# Altium schematic sheet MCU.SchDoc
size A3; SheetNumber: 6; SheetTotal: 8
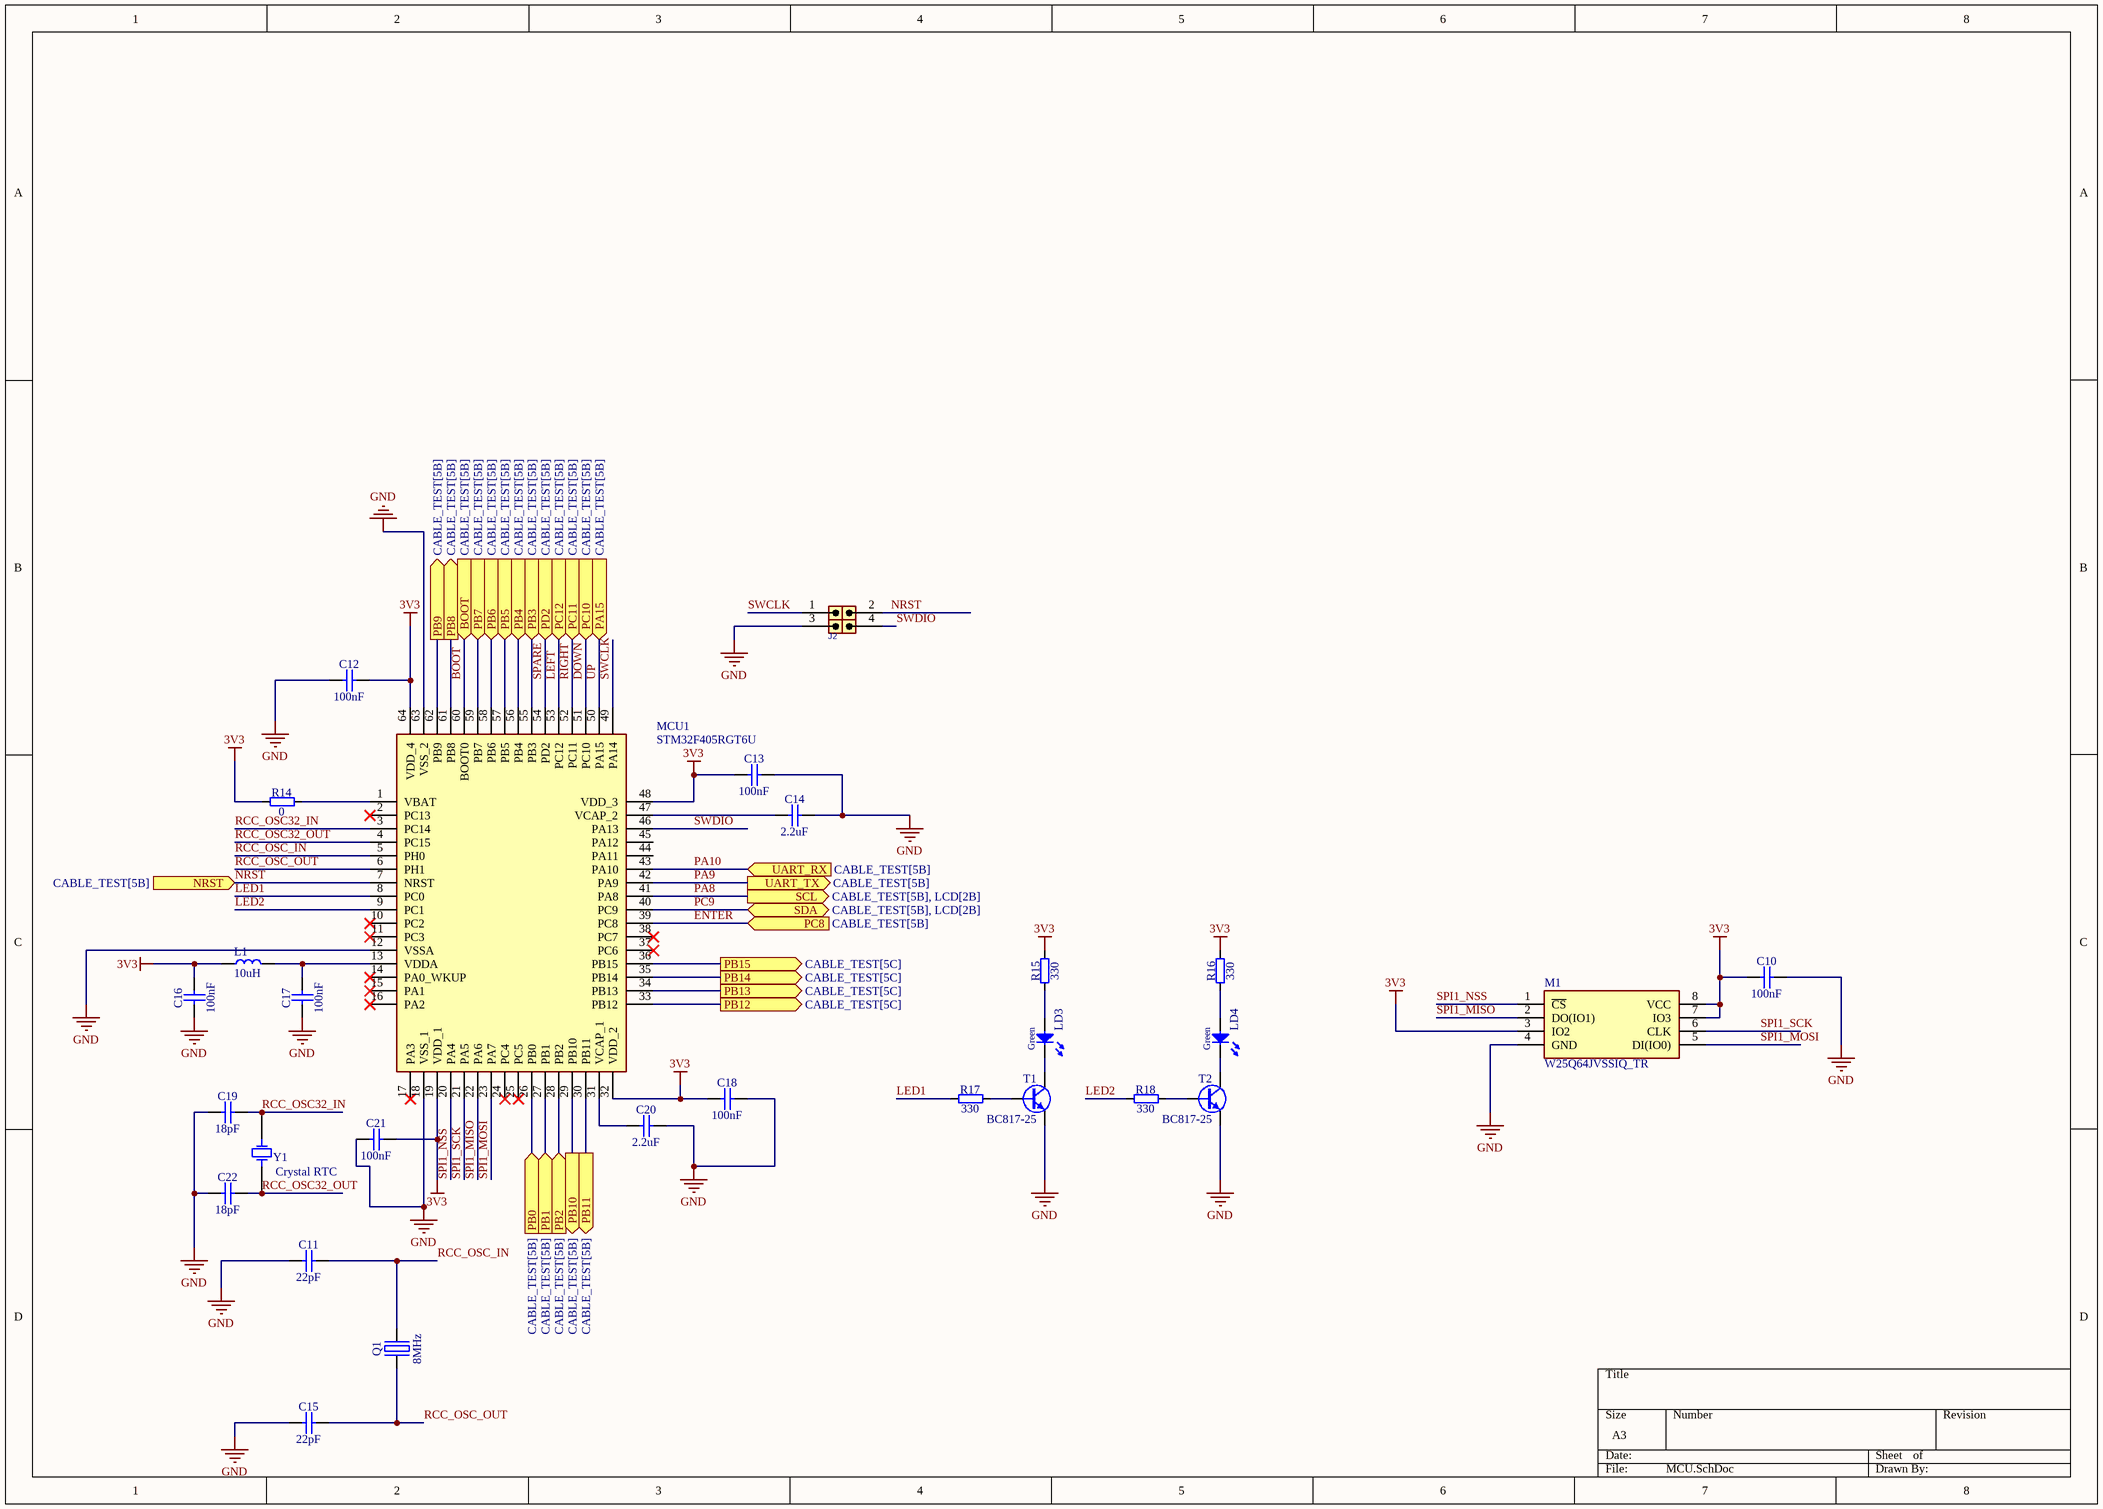
[diagram p0: MCU.SchDoc]

## Parts
C10  100nF  [CAPC2012X135N]
C11  22pF  [CAPC2012X135N]
C12  100nF  [CAPC2012X135N]
C13  100nF  [CAPC2012X135N]
C14  2.2uF  [CAPC2012X135N]
C15  22pF  [CAPC2012X135N]
C16  100nF  [CAPC2012X135N]
C17  100nF  [CAPC2012X135N]
C18  100nF  [CAPC2012X135N]
C19  18pF  [CAPC2012X135N]
C20  2.2uF  [CAPC2012X135N]
C21  100nF  [CAPC2012X135N]
C22  18pF  [CAPC2012X135N]
J2  Female Header dual 2  [HDR_F_2X2]  (value not drawn)
L1  value 10uH  [L0805]  (hidden comment: Inductor SMD NC 0805)
LD3  Green  [LED_3MM_GREEN_1C-2A]
LD4  Green  [LED_3MM_GREEN_1C-2A]
M1  W25Q64JVSSIQ_TR  [SOIC127P790X216-8N]
MCU1  STM32F405RGT6U  [QFP50P1200X1200X160-64N]
Q1  8MHz  [XTAL_CTS_ATS]
R14  0  [RESC2012X60N]
R15  330  [RESC2012X60N]
R16  330  [RESC2012X60N]
R17  330  [RESC2012X60N]
R18  330  [RESC2012X60N]
T1  BC817-25  [SOT95P230X110-3N]
T2  BC817-25  [SOT95P230X110-3N]
Y1  Crystal RTC  [Crystal Clock]

## Ports
BOOT (in, see CABLE_TEST[5B]), NRST (in, see CABLE_TEST[5B]), PA15 (in, see CABLE_TEST[5B]), PB0 (in, see CABLE_TEST[5B]), PB1 (in, see CABLE_TEST[5B]), PB2 (in, see CABLE_TEST[5B]), PB3 (in, see CABLE_TEST[5B]), PB4 (in, see CABLE_TEST[5B]), PB5 (in, see CABLE_TEST[5B]), PB6 (in, see CABLE_TEST[5B]), PB7 (in, see CABLE_TEST[5B]), PB8 (out, see CABLE_TEST[5B]), PB9 (out, see CABLE_TEST[5B]), PB10 (out, see CABLE_TEST[5B]), PB11 (out, see CABLE_TEST[5B]), PB12 (out, see CABLE_TEST[5C]), PB13 (out, see CABLE_TEST[5C]), PB14 (out, see CABLE_TEST[5C]), PB15 (out, see CABLE_TEST[5C]), PC8 (in, see CABLE_TEST[5B]), PC10 (in, see CABLE_TEST[5B]), PC11 (in, see CABLE_TEST[5B]), PC12 (in, see CABLE_TEST[5B]), PD2 (in, see CABLE_TEST[5B]), SCL (out, see CABLE_TEST[5B], LCD[2B]), SDA (bidir, see CABLE_TEST[5B], LCD[2B]), UART_RX (in, see CABLE_TEST[5B]), UART_TX (out, see CABLE_TEST[5B])

## Nets
3V3: C10.1 C12.2 C13.1 C16.2 C18.1 C21.2 L1.1 M1.3(IO2) M1.7(IO3) M1.8(VCC) MCU1.19(VDD_1) MCU1.32(VDD_2) MCU1.48(VDD_3) MCU1.64(VDD_4) R14.1 R15.2 R16.2
GND: C10.2 C11.1 C12.1 C13.2 C14.2 C15.1 C16.1 C17.1 C18.2 C19.1 C20.2 C21.1 C22.1 J2.3 M1.4(GND) MCU1.12(VSSA) MCU1.18(VSS_1) MCU1.63(VSS_2) T1.2(E) T2.2(E)
BOOT: MCU1.60(BOOT0) ; port BOOT
DOWN: MCU1.51(PC10) ; port PC10
ENTER: MCU1.39(PC8) ; port PC8
LED1: MCU1.8(PC0) R17.1
LED2: MCU1.9(PC1) R18.1
LEFT: MCU1.53(PC12) ; port PC12
NRST: J2.2 MCU1.7(NRST) ; port NRST
PA8: MCU1.41(PA8) ; port SCL
PA9: MCU1.42(PA9) ; port UART_TX
PA10: MCU1.43(PA10) ; port UART_RX
PB0: MCU1.26(PB0) ; port PB0
PB1: MCU1.27(PB1) ; port PB1
PB2: MCU1.28(PB2) ; port PB2
PB3: MCU1.55(PB3) ; port PB3
PB4: MCU1.56(PB4) ; port PB4
PB5: MCU1.57(PB5) ; port PB5
PB6: MCU1.58(PB6) ; port PB6
PB7: MCU1.59(PB7) ; port PB7
PB8: MCU1.61(PB8) ; port PB8
PB9: MCU1.62(PB9) ; port PB9
PB10: MCU1.29(PB10) ; port PB10
PB11: MCU1.30(PB11) ; port PB11
PB12: MCU1.33(PB12) ; port PB12
PB13: MCU1.34(PB13) ; port PB13
PB14: MCU1.35(PB14) ; port PB14
PB15: MCU1.36(PB15) ; port PB15
PC9: MCU1.40(PC9) ; port SDA
RCC_OSC32_IN: C19.2 MCU1.3(PC14) Y1.1
RCC_OSC32_OUT: C22.2 MCU1.4(PC15) Y1.2
RCC_OSC_IN: C11.2 MCU1.5(PH0) Q1.2(OSC2)
RCC_OSC_OUT: C15.2 MCU1.6(PH1) Q1.1(OSC1)
RIGHT: MCU1.52(PC11) ; port PC11
SPARE: MCU1.54(PD2) ; port PD2
SPI1_MISO: M1.2(DO(IO1)) MCU1.22(PA6)
SPI1_MOSI: M1.5(DI(IO0)) MCU1.23(PA7)
SPI1_NSS: M1.1(~{CS}) MCU1.20(PA4)
SPI1_SCK: M1.6(CLK) MCU1.21(PA5)
SWCLK: J2.1 MCU1.49(PA14)
SWDIO: J2.4 MCU1.46(PA13)
UP: MCU1.50(PA15) ; port PA15
NetC14_1: C14.1 MCU1.47(VCAP_2)
NetC17_2: C17.2 L1.2 MCU1.13(VDDA)
NetC20_1: C20.1 MCU1.31(VCAP_1)
NetLD3_1: LD3.1(C) T1.3(C)
NetLD3_2: LD3.2(A) R15.1
NetLD4_1: LD4.1(C) T2.3(C)
NetLD4_2: LD4.2(A) R16.1
NetMCU1_1: MCU1.1(VBAT) R14.2
NetR17_2: R17.2 T1.1(B)
NetR18_2: R18.2 T2.1(B)

Not connected (* = marked no-connect by the designer): MCU1 2(PC13)* 10(PC2)* 11(PC3)* 14(PA0_WKUP)* 15(PA1)* 16(PA2)* 17(PA3)* 24(PC4)* 25(PC5)* 37(PC6)* 38(PC7)* 44(PA11) 45(PA12)

## Library data of the parts
C10 = CC0805_1.2PF_50V_0.25PF_NP0: Non-polarised capacitor; Part Description: SMD Multilayer Chip Ceramic Capacitor; Manufacturer: GENERIC; Manufacturer1 Part Number: 223886114128; Voltage: 50V; TC: C0G/NP0; Tolerance: ±0.25pF; Part Number: CC0805_1.2PF_50V_0.25PF_NP0; Component Kind: Standard; Component Type: Standard; Pin Count: 2; Value: 100nF; Status: Not Recommended; Manufacturer Part Number: CC0805_1.2PF_50V_0.25PF_NP0; Case: 0805; Mounted: Yes; Socket: No; SMD: Yes; Sense: No; Manufacturer1 Example: PHYCOMP; Manufacturer1 ComponentHeight: 1.35mm; HelpURL: \\cern.ch\dfs\Applications\Altium\Datasheets\CC0805_NP0_PHYCOMP.pdf; Author: CERN DEM JLC; CreateDate: 12/3/2007; LatestRevisionDate: 12/3/2007
C11-C22 = CC0805_100NF_50V_10%_X7R: Non-polarised capacitor; Part Description: SMD Multilayer Chip Ceramic Capacitor; Manufacturer: GENERIC; Manufacturer1 Part Number: C2012X7R1H104K085; Voltage: 50V; TC: X7R; Tolerance: ±10%; Part Number: CC0805_100NF_50V_10%_X7R; Component Kind: Standard; Component Type: Standard; Pin Count: 2; Status: None; Manufacturer Part Number: CC0805_100NF_50V_10%_X7R; Case: 0805; Mounted: Yes; Socket: No; SMD: Yes; Sense: No; Manufacturer1 Example: TDK; Manufacturer1 ComponentHeight: 1mm; HelpURL: \\cern.ch\dfs\Applications\Altium\Datasheets\CC0805_X7R_TDK_C.pdf; Author: CERN DEM JLC; CreateDate: 12/3/2007; LatestRevisionDate: 4/22/2015
  C11 C15: Value: 22pF
  C12 C13 C16-C18 C21: Value: 100nF
  C14 C20: Value: 2.2uF
  C19 C22: Value: 18pF
J2 = Female Header dual 2: Female, pitch: 2.54mm; Category: Connector
L1 = Inductor SMD NC 0805: Current: 200mA; IPN: 1030; Category: inductor; Package: 0805; Mounting Type: SMD
LD3 LD4 = LED_AVAGO_HLMP-1790: LED Green 1C 2A; Part Description: 3mm Green LED; Manufacturer: AVAGO TECHNOLOGIES; PressFit: No; Bonding: No; Part Number: LED_AVAGO_HLMP-1790; Component Kind: Standard; Component Type: Standard; Color: Green; PackageDescription: LED, Green, Body Dia. 3.43 mm, Pin spacing 2.54mm; Manufacturer Part Number: HLMP-1790; Pin Count: 2; Mounted: Yes; Socket: No; SMD: No; Sense: No; ComponentHeight: 6.35mm(min); HelpURL: \\cern.ch\dfs\Applications\Altium\Datasheets\LED_AVAGO_HLMP-1790.pdf; Author: CERN DEM JLC; CreateDate: 6/12/2008; LatestRevisionDate: 3/17/2010
M1 = W25Q64JVSSIQ_TR: Integrated Circuit; Manufacturer_Name: Winbond; Manufacturer_Part_Number: W25Q64JVSSIQ TR; Datasheet Link: http://www.winbond.com/resource-files/w25q64jv%20spi%20revg%2012142016.pdf; Height: 2.16mm; Mouser Part Number: 454-W25Q64JVSSIQTR; Mouser Price/Stock: https://www.mouser.co.uk/ProductDetail/Winbond/W25Q64JVSSIQ-TR?qs=qSfuJ%252Bfl%2Fd6FZTXsjBFnrA%3D%3D; Arrow Part Number: W25Q64JVSSIQ TR; Arrow Price/Stock: https://www.arrow.com/en/products/w25q64jvssiqtr/winbond-electronics?utm_currency=USD&region=nac
MCU1 = STM32F405RGT6U: Integrated Circuit; Manufacturer_Name: STMicroelectronics; Height: 1.6mm; Manufacturer_Part_Number: STM32F405RGT6U; Mouser Part Number: 511-STM32F405RGT6U; Mouser Price/Stock: https://www.mouser.co.uk/ProductDetail/STMicroelectronics/STM32F405RGT6U?qs=4ccVDqXDOrkfyBTYAli8sw%3D%3D
Q1 = XTAL_10MHZ_CTS_ATS100B-E: Quartz Crystal; Part Description: Tolerance: ±30ppm, Stability: ±50ppm, -40°C to +85°C, 18pF, 40 Ohms ESR, Quartz Crystal, ATS Series; Manufacturer: CTS; PressFit: No; Bonding: No; Part Number: XTAL_10MHZ_CTS_ATS100B-E; Component Kind: Standard; Component Type: Standard; PackageDescription: THD Crystal,HC-49/US Case Body 10.85x4.5mm; Pitch 4.88mm; Value: 8MHz; Manufacturer Part Number: ATS100B-E; Pin Count: 2; Mounted: Yes; Socket: No; SMD: No; Sense: No; ComponentHeight: 3.3mm; HelpURL: \\cern.ch\dfs\Applications\Altium\Datasheets\XTAL_CTS_ATS.pdf; Author: CERN DEM HF; CreateDate: 10/25/2022; LatestRevisionDate: 10/25/2022
R14-R18 = R0805_24K_1%_0.125W_100PPM: Resistor - 1%; Part Description: General Purpose Thick Film Chip Resistor; Manufacturer: GENERIC; Manufacturer1 Part Number: NRC10F2402TRF; Power: 0.125W; TC: ±100ppm/°C; PressFit: No; Part Number: R0805_24K_1%_0.125W_100PPM; Component Kind: Standard; Component Type: Standard; Pin Count: 2; Status: Preferred; Tolerance: ±1%; Manufacturer Part Number: R0805_24K_1%_0.125W_100PPM; Case: 0805; Mounted: Yes; Sense: No; Socket: No; SMD: Yes; HelpURL: \\cern.ch\dfs\Applications\Altium\Datasheets\R0805_NIC_NRC.pdf; Author: CERN DEM JLC; CreateDate: 12/3/2007; LatestRevisionDate: 3/13/2008; Manufacturer1 Example: NIC COMPONENT; Manufacturer1 ComponentHeight: 0.6mm
  R14: Value: 0
  R15-R18: Value: 330
T1 T2 = BC817-25: NPN Transistor; Part Description: 45V 500mA NPN General-Purpose Transistor; Manufacturer: NXP SEMICONDUCTORS; PressFit: No; Bonding: No; Part Number: BC817-25; Component Kind: Standard; Component Type: Standard; Device: BC817-25; PackageDescription: SOT23, 0.95mm Pitch; 3 Pin, 1.30mm W X 2.90mm L X 1.10mm H body, IPC Medium Density; Manufacturer Part Number: BC817-25; Pin Count: 3; Case: SOT23-3; Mounted: Yes; Socket: No; SMD: Yes; Sense: No; ComponentHeight: 1.1mm; HelpURL: \\cern.ch\dfs\Applications\Altium\Datasheets\BC817-25.pdf; Author: CERN DEM JLC; CreateDate: 10/28/2014; LatestRevisionDate: 10/28/2014
Y1 = Crystal RTC: Crystal; Category: Crystal